# Altium schematic sheet Sheet1.SchDoc
size 431 x 279 mm; SheetNumber: 1; SheetTotal: 1; ENG_APP_DATE: --/--/--; DSN_APP_DATE: --/--/--; CHK_APP_DATE: --/--/--
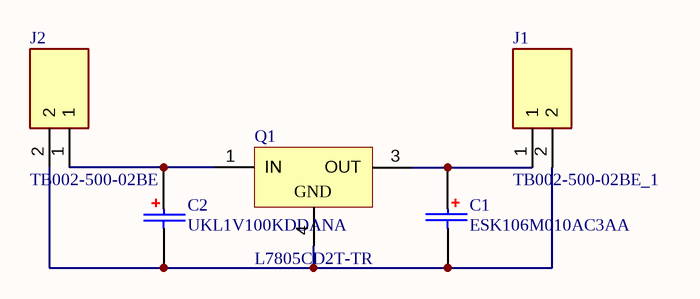
[diagram p0: Sheet1.SchDoc]

## Parts
C1  ESK106M010AC3AA  [ESK106M010AC3AA]
C2  UKL1V100KDDANA  [CAP_UKL_5X11_NCH]
J1  TB002-500-02BE_1  [CUI_TB002-500-02BE - duplicate]
J2  TB002-500-02BE  [CUI_TB002-500-02BE]
Q1  L7805CD2T-TR  [3]

## Nets
NetC1_1: C1.1 J1.1 Q1.3(OUT)
NetC1_2: C1.2 C2.2 J1.2 J2.2 Q1.4(GND)
NetC2_1: C2.1 J2.1 Q1.1(IN)

## Notes on the sheet
- DWG. NO.
- REV.
- SHT.
- THIS DOCUMENT AND THE DATA DISCLOSED HEREIN OR HEREWITH IS THE PROPERTY OF ALTIUM LIMITED AND MAY BE FREELY DISTRIBUTED IN WHOLE. NO RIGHTS ARE RESERVED OR EXPRESS OR IMPLIED WARANTEE GIVEN.
- REVISION
- DESCRIPTION
- DATE
- APPROVED
- ENG:
- APPROVALS
- PROJECT
- DSN:
- CHK:
- REFERENCE DOCUMENTS
- PROJECT REVISION:
- TITLE
- DOCUMENT REVISION:
- DESIGN ITEM:
- BOM:
- FAB DWG:
- PCB DWG:
- ASSY DWG:
- SCALE:
- SIZE
- B
- CAGE CODE
- FILE NAME
- DWG NO.
- SHEET
- OF
- REV

## Library data of the parts
C1 = ESK106M010AC3AA: Aluminum Electrolytic Capacitor, Polarized, Aluminum (wet), 10V, 20% +Tol, 20% -Tol, 10uF, Through Hole Mount; Manufacturer: Yageo Group; Value: 10µF; Leakage Current: 3µA; Ripple Current: 35mA; Supplier: DigiKey; Supplier Part Number: 399-ESK106M010AC3AA-ND; Manufacturer Part Number: ESK106M010AC3AA; RoHS: Compliant; Category: Aluminum Electrolytic Capacitors; Stock: 31925; Pricing: 1=0.22, 10=0.133, 50=0.096, 100=0.0841, 500=0.0635, 1000=0.05698, 2500=0.05, 5000=0.04574 (USD); Diameter: 5mm; Export Control Classification Number (ECCN) Code: EAR99; Harmonized Tariff Schedule (HTS) Code: 8532.22.00.20; Introduction Date: 2006-12-04; Length: 11mm; Lifecycle Status: Production; Max Operating Temperature: 85°C; Min Operating Temperature: -40°C; Number of Terminals: 2; Packaging: Bulk; REACH SVHC: Yes; Terminal Pitch: 2mm; Voltage Rating (DC): 10V; ComponentLink1URL: https://datasheet.octopart.com:443/ESK106M010AC3AA-KEMET-datasheet-182055911.pdf?src-supplier=IHS; ComponentLink1Description: https://datasheet.octopart.com:443/ESK106M010AC3AA-KEMET-datasheet-182055911.pdf?src-supplier=IHS; ComponentLink2URL: https://datasheet.octopart.com:443/ESK106M010AC3AA-KEMET-datasheet-182942742.pdf?src-supplier=Farnell; ComponentLink2Description: https://datasheet.octopart.com:443/ESK106M010AC3AA-KEMET-datasheet-182942742.pdf?src-supplier=Farnell
C2 = UKL1V100KDDANA: Aluminum Electrolytic Capacitor, 10UF, 35V, 10%, Radial; Manufacturer: Nichicon; Value: 10µF; Life (Hours): 1000hours; Polarity: Polar; Supplier: Arrow Electronics; Supplier Part Number: UKL1V100KDDANA; Manufacturer Part Number: UKL1V100KDDANA; RoHS: Compliant; Category: Aluminum Electrolytic Capacitors; Stock: 1313; Pricing: 716=0.1396, 1000=0.1296 (USD); Case/Package: Radial; Lead Pitch: 2mm; Max Operating Temperature: 105°C; Min Operating Temperature: -40°C; Mounting Technology: Through Hole; Schedule B: 8532290040, 8532290040|8532290040|8532290040|8532290040|8532290040|8532290040|8532290040|8532290040|8532290040|8532290040|8532290040|8532290040|8532290040|8532290040|8532290040|8532290040|8532290040|8532290040|8532290040|8532290040|8532290040|8532290040|8532290040|85; Termination: Radial; Tolerance: 10%; Voltage Rating: 35V; Voltage Rating (DC): 35V; ComponentLink1URL: https://datasheet.octopart.com:443/UKL1V100KDDANA-Nichicon-datasheet-41194111.pdf?src-supplier=Newark; ComponentLink1Description: https://datasheet.octopart.com:443/UKL1V100KDDANA-Nichicon-datasheet-41194111.pdf?src-supplier=Newark; ComponentLink2URL: https://datasheet.octopart.com:443/UKL1V100KDDANA-Nichicon-datasheet-21209594.pdf?src-supplier=Newark; ComponentLink2Description: https://datasheet.octopart.com:443/UKL1V100KDDANA-Nichicon-datasheet-21209594.pdf?src-supplier=Newark
J1 = TB002-500-02BE_1: Barrier Strip Terminal Block 15A 3.31Mm2 1 Row Rohs Compliant: Yes |Same Sky TB002-500-02BE; Approvals: CE, EN, IEC, UL, cUL; Number of Contacts: 2; Number of Levels: 1; Pitch: 5mm; Voltage Rating: 300V; Wire/Cable Gauge: 12AWG; Supplier: DigiKey; Supplier Part Number: 102-6145-ND; Manufacturer: Same Sky; Manufacturer Part Number: TB002-500-02BE; RoHS: Compliant; Category: Terminal Blocks; Stock: 34381; Pricing: 1=0.33, 10=0.251, 25=0.22, 50=0.1984, 100=0.1787, 250=0.15652, 500=0.14278, 3000=0.11772, 6000=0.11131 (USD); Color: Blue; Current Rating: 15A; Export Control Classification Number (ECCN) Code: EAR99; Height: 10mm; Harmonized Tariff Schedule (HTS) Code: 8536.90.40.00; Introduction Date: 2024-10-09; Lifecycle Status: Production; Max Operating Temperature: 105°C; Min Operating Temperature: -40°C; Mounting Technology: Screw; Pins: 2; Number of Rows: 1; Orientation: Horizontal; REACH SVHC: No; Width: 7.6mm; ComponentLink1URL: https://datasheet.octopart.com:443/TB002-500-02BE-Same-Sky-datasheet-181920249.pdf?src-supplier=Same+Sky; ComponentLink1Description: https://datasheet.octopart.com:443/TB002-500-02BE-Same-Sky-datasheet-181920249.pdf?src-supplier=Same+Sky; ComponentLink2URL: https://datasheet.octopart.com:443/TB002-500-02BE-CUI-Devices-datasheet-175928133.pdf?src-supplier=Same+Sky; ComponentLink2Description: https://datasheet.octopart.com:443/TB002-500-02BE-CUI-Devices-datasheet-175928133.pdf?src-supplier=Same+Sky; ComponentLink3URL: https://datasheet.octopart.com:443/TB002-500-02BE-CUI-Devices-datasheet-144794938.pdf?src-supplier=Same+Sky; ComponentLink3Description: https://datasheet.octopart.com:443/TB002-500-02BE-CUI-Devices-datasheet-144794938.pdf?src-supplier=Same+Sky; ComponentLink4URL: https://datasheet.octopart.com:443/TB002-500-02BE-CUI-Devices-datasheet-180438470.pdf?src-supplier=IHS; ComponentLink4Description: https://datasheet.octopart.com:443/TB002-500-02BE-CUI-Devices-datasheet-180438470.pdf?src-supplier=IHS; ComponentLink5URL: https://datasheet.octopart.com:443/TB002-500-02BE-Same-Sky-datasheet-190142077.pdf?src-supplier=element14+APAC; ComponentLink5Description: https://datasheet.octopart.com:443/TB002-500-02BE-Same-Sky-datasheet-190142077.pdf?src-supplier=element14+APAC; ComponentLink6URL: https://datasheet.octopart.com:443/TB002-500-02BE-Same-Sky-datasheet-182881440.pdf?src-supplier=Electro+Sonic; ComponentLink6Description: https://datasheet.octopart.com:443/TB002-500-02BE-Same-Sky-datasheet-182881440.pdf?src-supplier=Electro+Sonic; ComponentLink7URL: https://datasheet.octopart.com:443/TB002-500-02BE-CUI-Devices-datasheet-154730744.pdf?src-supplier=Electro+Sonic; ComponentLink7Description: https://datasheet.octopart.com:443/TB002-500-02BE-CUI-Devices-datasheet-154730744.pdf?src-supplier=Electro+Sonic; ComponentLink8URL: https://datasheet.octopart.com:443/TB002-500-02BE-Same-Sky-datasheet-189105710.pdf?src-supplier=Master+Electronics; ComponentLink8Description: https://datasheet.octopart.com:443/TB002-500-02BE-Same-Sky-datasheet-189105710.pdf?src-supplier=Master+Electronics; ComponentLink9URL: https://datasheet.octopart.com:443/TB002-500-02BE-Same-Sky-datasheet-182050243.pdf?src-supplier=Future+Electronics; ComponentLink9Description: https://datasheet.octopart.com:443/TB002-500-02BE-Same-Sky-datasheet-182050243.pdf?src-supplier=Future+Electronics; ComponentLink10URL: https://datasheet.octopart.com:443/TB002-500-02BE-CUI-Devices-datasheet-175928501.pdf?src-supplier=Future+Electronics; ComponentLink10Description: https://datasheet.octopart.com:443/TB002-500-02BE-CUI-Devices-datasheet-175928501.pdf?src-supplier=Future+Electronics; ComponentLink11URL: https://datasheet.octopart.com:443/TB002-500-02BE-CUI-Devices-datasheet-147843962.pdf?src-supplier=Future+Electronics; ComponentLink11Description: https://datasheet.octopart.com:443/TB002-500-02BE-CUI-Devices-datasheet-147843962.pdf?src-supplier=Future+Electronics; ComponentLink12URL: https://datasheet.octopart.com:443/TB002-500-02BE-CUI-Devices-datasheet-175927966.pdf?src-supplier=CUI+Devices+SCT; ComponentLink12Description: https://datasheet.octopart.com:443/TB002-500-02BE-CUI-Devices-datasheet-175927966.pdf?src-supplier=CUI+Devices+SCT; ComponentLink13URL: https://datasheet.octopart.com:443/TB002-500-02BE-CUI-Devices-datasheet-142371903.pdf?src-supplier=CUI+Devices+SCT; ComponentLink13Description: https://datasheet.octopart.com:443/TB002-500-02BE-CUI-Devices-datasheet-142371903.pdf?src-supplier=CUI+Devices+SCT; ComponentLink14URL: https://octopart.com:443/opatz8j6/c1?t=daKBr15hyLfguRN5uL4lqHwqeBTS6az6UucewCHyGpHtbux7pAfp6Q9QTNCXQgOeNdQI5afNcTbVzuunJIpqJo1-AAwsQ2Q7JOXJZD681kNYD1MgHtXQHZHp1a0nqQtGAiROF49UX8-aPEOMvwhp8kgluEx9dPMerVMsFpBX7o971noVxpZNPL8Hx6Gpa6r9mfx1LNEp29a1YZcEevAsGAGUzEl2dkpqtMJYMZmyUQjREWhpQSjNqecDkfUZGekDVGXfEcG2TRJlxSfy9vfBJeva8kdH7IQ0IVFh_6hMjsgc6sAg4IaeyZW4NT_AhTfA9Bm9OYf2zlsTSP3XXn_68K8kkp-OnblrwRCl164jRg8MMQ&src-supplier=Compliance+Statements; ComponentLink14Description: https://octopart.com:443/opatz8j6/c1?t=daKBr15hyLfguRN5uL4lqHwqeBTS6az6UucewCHyGpHtbux7pAfp6Q9QTNCXQgOeNdQI5afNcTbVzuunJIpqJo1-AAwsQ2Q7JOXJZD681kNYD1MgHtXQHZHp1a0nqQtGAiROF49UX8-aPEOMvwhp8kgluEx9dPMerVMsFpBX7o971noVxpZNPL8Hx6Gpa6r9mfx1LNEp29a1YZcEevAsGAGUzEl2dkpqtMJYMZmyUQjREWhpQSjNqecDkfUZGekDVGXfEcG2TRJlxSfy9vfBJeva8kdH7IQ0IVFh_6hMjsgc6sAg4IaeyZW4NT_AhTfA9Bm9OYf2zlsTSP3XXn_68K8kkp-OnblrwRCl164jRg8MMQ&src-supplier=Compliance+Statements; ComponentLink15URL: https://octopart.com:443/opatz8j6/c1?t=zlDsDuB8Wed5ydZmw8jFMRsA8Ara5MDCNrUaIAHxqjyN6vx98jw4VnAGME3ScJGCxj47SrSmKWgHBCn-rFMB4ZC3UR8QbcT0CNN9dQPCpKwHKvJBjhUr0Cc3P59X1v-rX_KJ4iyG6mpbrB21C3EBek8w_56z5cqdj2kGiI-RC-b0iWoknjsJGcZJ7qMZ4pM9OpDpdClOUvaERoFT87nGO8QMYDFPVhkITy7GuzVBxmCx_Iz70dqc9wYrFUSQHKH-wqo17XScDRowI-te1iX7ZQ96WPgM7ocEB65Ptcncwv82UAUFxSU-ZbfbRWRth_BEn15Jj-QLglzApIC_l7nFdInrGmwm-kH9RoGbdipM&src-supplier=Compliance+Statements; ComponentLink15Description: https://octopart.com:443/opatz8j6/c1?t=zlDsDuB8Wed5ydZmw8jFMRsA8Ara5MDCNrUaIAHxqjyN6vx98jw4VnAGME3ScJGCxj47SrSmKWgHBCn-rFMB4ZC3UR8QbcT0CNN9dQPCpKwHKvJBjhUr0Cc3P59X1v-rX_KJ4iyG6mpbrB21C3EBek8w_56z5cqdj2kGiI-RC-b0iWoknjsJGcZJ7qMZ4pM9OpDpdClOUvaERoFT87nGO8QMYDFPVhkITy7GuzVBxmCx_Iz70dqc9wYrFUSQHKH-wqo17XScDRowI-te1iX7ZQ96WPgM7ocEB65Ptcncwv82UAUFxSU-ZbfbRWRth_BEn15Jj-QLglzApIC_l7nFdInrGmwm-kH9RoGbdipM&src-supplier=Compliance+Statements; ComponentLink16URL: https://octopart.com:443/opatz8j6/c1?t=EWJW4z4XJi7pQiIZnWuGCfUnRu0ZN4v9GnIyKU2Q7zR-Wd37eki--RRH7MgCaHpQbiJwnDn8Frgwb2ersLG33WwjXx4BsND04t8rFqVurkeLStMIXmGI8cNHmKCj-BCAkUnWXSAQ2snsAsqjLUqg6-hP3W5-V0VbKwjBsYWtlNCJzACsJ3N0Pk6rg4zOJDPFqQrxlEAltsulaj6ZjZlQ3q-Y1DKbDmgONhU2NgiMFg9fSQjUP7rx1X0m8hRymFov1EzBC4OrloELxhiUuHPXXp0CVZMcl3T5lkY7d4XdTM7N-SAKnWAcyezcHeXTBawL8JV9dWi9l8duXjkjrJCzJlcJ-meM_jYAnu5rfZ5g2E_9xw&src-supplier=Compliance+Statements; ComponentLink16Description: https://octopart.com:443/opatz8j6/c1?t=EWJW4z4XJi7pQiIZnWuGCfUnRu0ZN4v9GnIyKU2Q7zR-Wd37eki--RRH7MgCaHpQbiJwnDn8Frgwb2ersLG33WwjXx4BsND04t8rFqVurkeLStMIXmGI8cNHmKCj-BCAkUnWXSAQ2snsAsqjLUqg6-hP3W5-V0VbKwjBsYWtlNCJzACsJ3N0Pk6rg4zOJDPFqQrxlEAltsulaj6ZjZlQ3q-Y1DKbDmgONhU2NgiMFg9fSQjUP7rx1X0m8hRymFov1EzBC4OrloELxhiUuHPXXp0CVZMcl3T5lkY7d4XdTM7N-SAKnWAcyezcHeXTBawL8JV9dWi9l8duXjkjrJCzJlcJ-meM_jYAnu5rfZ5g2E_9xw&src-supplier=Compliance+Statements; ComponentLink17URL: https://octopart.com:443/opatz8j6/c1?t=-oFJp4s286qNHvtoD2sI4obiiM3f3ZehqgE9hmXp3EI9PlQz1D01F7GaALZrUSRmFFvymU-LPWxG06MbCGc2ZY5TyZVTnJ_kA4vhYiCoKt1zkHzlKfJJsA5blW3U2kSfIgjaDy43q_XJT2g3XxMdO2I5pwfNScTUKNHDD-GtoZItPQ5-9ldbL0ohlBdl9uYO8B-TCkdG5OoHFKexMb_OuUnDeUuET5p44IIsKIsqDM6BGWGXXeLy1F8-Oxi0NW1hLCwG2fvyj7l-m3XVzD2x8eyAwNGLXhsrsWiY3E1M0w6jjBeSui3X-iw7gCcZbIw8KaT6YRWKdUle1InoHCrQLBF_0zC7yoT7t99L0yBf&src-supplier=Compliance+Statements; ComponentLink17Description: https://octopart.com:443/opatz8j6/c1?t=-oFJp4s286qNHvtoD2sI4obiiM3f3ZehqgE9hmXp3EI9PlQz1D01F7GaALZrUSRmFFvymU-LPWxG06MbCGc2ZY5TyZVTnJ_kA4vhYiCoKt1zkHzlKfJJsA5blW3U2kSfIgjaDy43q_XJT2g3XxMdO2I5pwfNScTUKNHDD-GtoZItPQ5-9ldbL0ohlBdl9uYO8B-TCkdG5OoHFKexMb_OuUnDeUuET5p44IIsKIsqDM6BGWGXXeLy1F8-Oxi0NW1hLCwG2fvyj7l-m3XVzD2x8eyAwNGLXhsrsWiY3E1M0w6jjBeSui3X-iw7gCcZbIw8KaT6YRWKdUle1InoHCrQLBF_0zC7yoT7t99L0yBf&src-supplier=Compliance+Statements
J2 = TB002-500-02BE: Barrier Strip Terminal Block 15A 3.31Mm2 1 Row Rohs Compliant: Yes |Same Sky TB002-500-02BE; Approvals: CE, EN, IEC, UL, cUL; Number of Contacts: 2; Number of Levels: 1; Pitch: 5mm; Voltage Rating: 300V; Wire/Cable Gauge: 12AWG; Supplier: DigiKey; Supplier Part Number: 102-6145-ND; Manufacturer: Same Sky; Manufacturer Part Number: TB002-500-02BE; RoHS: Compliant; Category: Terminal Blocks; Stock: 34381; Pricing: 1=0.33, 10=0.251, 25=0.22, 50=0.1984, 100=0.1787, 250=0.15652, 500=0.14278, 3000=0.11772, 6000=0.11131 (USD); Color: Blue; Current Rating: 15A; Export Control Classification Number (ECCN) Code: EAR99; Height: 10mm; Harmonized Tariff Schedule (HTS) Code: 8536.90.40.00; Introduction Date: 2024-10-09; Lifecycle Status: Production; Max Operating Temperature: 105°C; Min Operating Temperature: -40°C; Mounting Technology: Screw; Pins: 2; Number of Rows: 1; Orientation: Horizontal; REACH SVHC: No; Width: 7.6mm; ComponentLink1URL: https://datasheet.octopart.com:443/TB002-500-02BE-Same-Sky-datasheet-181920249.pdf?src-supplier=Same+Sky; ComponentLink1Description: https://datasheet.octopart.com:443/TB002-500-02BE-Same-Sky-datasheet-181920249.pdf?src-supplier=Same+Sky; ComponentLink2URL: https://datasheet.octopart.com:443/TB002-500-02BE-CUI-Devices-datasheet-175928133.pdf?src-supplier=Same+Sky; ComponentLink2Description: https://datasheet.octopart.com:443/TB002-500-02BE-CUI-Devices-datasheet-175928133.pdf?src-supplier=Same+Sky; ComponentLink3URL: https://datasheet.octopart.com:443/TB002-500-02BE-CUI-Devices-datasheet-144794938.pdf?src-supplier=Same+Sky; ComponentLink3Description: https://datasheet.octopart.com:443/TB002-500-02BE-CUI-Devices-datasheet-144794938.pdf?src-supplier=Same+Sky; ComponentLink4URL: https://datasheet.octopart.com:443/TB002-500-02BE-CUI-Devices-datasheet-180438470.pdf?src-supplier=IHS; ComponentLink4Description: https://datasheet.octopart.com:443/TB002-500-02BE-CUI-Devices-datasheet-180438470.pdf?src-supplier=IHS; ComponentLink5URL: https://datasheet.octopart.com:443/TB002-500-02BE-Same-Sky-datasheet-190142077.pdf?src-supplier=element14+APAC; ComponentLink5Description: https://datasheet.octopart.com:443/TB002-500-02BE-Same-Sky-datasheet-190142077.pdf?src-supplier=element14+APAC; ComponentLink6URL: https://datasheet.octopart.com:443/TB002-500-02BE-Same-Sky-datasheet-182881440.pdf?src-supplier=Electro+Sonic; ComponentLink6Description: https://datasheet.octopart.com:443/TB002-500-02BE-Same-Sky-datasheet-182881440.pdf?src-supplier=Electro+Sonic; ComponentLink7URL: https://datasheet.octopart.com:443/TB002-500-02BE-CUI-Devices-datasheet-154730744.pdf?src-supplier=Electro+Sonic; ComponentLink7Description: https://datasheet.octopart.com:443/TB002-500-02BE-CUI-Devices-datasheet-154730744.pdf?src-supplier=Electro+Sonic; ComponentLink8URL: https://datasheet.octopart.com:443/TB002-500-02BE-Same-Sky-datasheet-189105710.pdf?src-supplier=Master+Electronics; ComponentLink8Description: https://datasheet.octopart.com:443/TB002-500-02BE-Same-Sky-datasheet-189105710.pdf?src-supplier=Master+Electronics; ComponentLink9URL: https://datasheet.octopart.com:443/TB002-500-02BE-Same-Sky-datasheet-182050243.pdf?src-supplier=Future+Electronics; ComponentLink9Description: https://datasheet.octopart.com:443/TB002-500-02BE-Same-Sky-datasheet-182050243.pdf?src-supplier=Future+Electronics; ComponentLink10URL: https://datasheet.octopart.com:443/TB002-500-02BE-CUI-Devices-datasheet-175928501.pdf?src-supplier=Future+Electronics; ComponentLink10Description: https://datasheet.octopart.com:443/TB002-500-02BE-CUI-Devices-datasheet-175928501.pdf?src-supplier=Future+Electronics; ComponentLink11URL: https://datasheet.octopart.com:443/TB002-500-02BE-CUI-Devices-datasheet-147843962.pdf?src-supplier=Future+Electronics; ComponentLink11Description: https://datasheet.octopart.com:443/TB002-500-02BE-CUI-Devices-datasheet-147843962.pdf?src-supplier=Future+Electronics; ComponentLink12URL: https://datasheet.octopart.com:443/TB002-500-02BE-CUI-Devices-datasheet-175927966.pdf?src-supplier=CUI+Devices+SCT; ComponentLink12Description: https://datasheet.octopart.com:443/TB002-500-02BE-CUI-Devices-datasheet-175927966.pdf?src-supplier=CUI+Devices+SCT; ComponentLink13URL: https://datasheet.octopart.com:443/TB002-500-02BE-CUI-Devices-datasheet-142371903.pdf?src-supplier=CUI+Devices+SCT; ComponentLink13Description: https://datasheet.octopart.com:443/TB002-500-02BE-CUI-Devices-datasheet-142371903.pdf?src-supplier=CUI+Devices+SCT; ComponentLink14URL: https://octopart.com:443/opatz8j6/c1?t=daKBr15hyLfguRN5uL4lqHwqeBTS6az6UucewCHyGpHtbux7pAfp6Q9QTNCXQgOeNdQI5afNcTbVzuunJIpqJo1-AAwsQ2Q7JOXJZD681kNYD1MgHtXQHZHp1a0nqQtGAiROF49UX8-aPEOMvwhp8kgluEx9dPMerVMsFpBX7o971noVxpZNPL8Hx6Gpa6r9mfx1LNEp29a1YZcEevAsGAGUzEl2dkpqtMJYMZmyUQjREWhpQSjNqecDkfUZGekDVGXfEcG2TRJlxSfy9vfBJeva8kdH7IQ0IVFh_6hMjsgc6sAg4IaeyZW4NT_AhTfA9Bm9OYf2zlsTSP3XXn_68K8kkp-OnblrwRCl164jRg8MMQ&src-supplier=Compliance+Statements; ComponentLink14Description: https://octopart.com:443/opatz8j6/c1?t=daKBr15hyLfguRN5uL4lqHwqeBTS6az6UucewCHyGpHtbux7pAfp6Q9QTNCXQgOeNdQI5afNcTbVzuunJIpqJo1-AAwsQ2Q7JOXJZD681kNYD1MgHtXQHZHp1a0nqQtGAiROF49UX8-aPEOMvwhp8kgluEx9dPMerVMsFpBX7o971noVxpZNPL8Hx6Gpa6r9mfx1LNEp29a1YZcEevAsGAGUzEl2dkpqtMJYMZmyUQjREWhpQSjNqecDkfUZGekDVGXfEcG2TRJlxSfy9vfBJeva8kdH7IQ0IVFh_6hMjsgc6sAg4IaeyZW4NT_AhTfA9Bm9OYf2zlsTSP3XXn_68K8kkp-OnblrwRCl164jRg8MMQ&src-supplier=Compliance+Statements; ComponentLink15URL: https://octopart.com:443/opatz8j6/c1?t=zlDsDuB8Wed5ydZmw8jFMRsA8Ara5MDCNrUaIAHxqjyN6vx98jw4VnAGME3ScJGCxj47SrSmKWgHBCn-rFMB4ZC3UR8QbcT0CNN9dQPCpKwHKvJBjhUr0Cc3P59X1v-rX_KJ4iyG6mpbrB21C3EBek8w_56z5cqdj2kGiI-RC-b0iWoknjsJGcZJ7qMZ4pM9OpDpdClOUvaERoFT87nGO8QMYDFPVhkITy7GuzVBxmCx_Iz70dqc9wYrFUSQHKH-wqo17XScDRowI-te1iX7ZQ96WPgM7ocEB65Ptcncwv82UAUFxSU-ZbfbRWRth_BEn15Jj-QLglzApIC_l7nFdInrGmwm-kH9RoGbdipM&src-supplier=Compliance+Statements; ComponentLink15Description: https://octopart.com:443/opatz8j6/c1?t=zlDsDuB8Wed5ydZmw8jFMRsA8Ara5MDCNrUaIAHxqjyN6vx98jw4VnAGME3ScJGCxj47SrSmKWgHBCn-rFMB4ZC3UR8QbcT0CNN9dQPCpKwHKvJBjhUr0Cc3P59X1v-rX_KJ4iyG6mpbrB21C3EBek8w_56z5cqdj2kGiI-RC-b0iWoknjsJGcZJ7qMZ4pM9OpDpdClOUvaERoFT87nGO8QMYDFPVhkITy7GuzVBxmCx_Iz70dqc9wYrFUSQHKH-wqo17XScDRowI-te1iX7ZQ96WPgM7ocEB65Ptcncwv82UAUFxSU-ZbfbRWRth_BEn15Jj-QLglzApIC_l7nFdInrGmwm-kH9RoGbdipM&src-supplier=Compliance+Statements; ComponentLink16URL: https://octopart.com:443/opatz8j6/c1?t=EWJW4z4XJi7pQiIZnWuGCfUnRu0ZN4v9GnIyKU2Q7zR-Wd37eki--RRH7MgCaHpQbiJwnDn8Frgwb2ersLG33WwjXx4BsND04t8rFqVurkeLStMIXmGI8cNHmKCj-BCAkUnWXSAQ2snsAsqjLUqg6-hP3W5-V0VbKwjBsYWtlNCJzACsJ3N0Pk6rg4zOJDPFqQrxlEAltsulaj6ZjZlQ3q-Y1DKbDmgONhU2NgiMFg9fSQjUP7rx1X0m8hRymFov1EzBC4OrloELxhiUuHPXXp0CVZMcl3T5lkY7d4XdTM7N-SAKnWAcyezcHeXTBawL8JV9dWi9l8duXjkjrJCzJlcJ-meM_jYAnu5rfZ5g2E_9xw&src-supplier=Compliance+Statements; ComponentLink16Description: https://octopart.com:443/opatz8j6/c1?t=EWJW4z4XJi7pQiIZnWuGCfUnRu0ZN4v9GnIyKU2Q7zR-Wd37eki--RRH7MgCaHpQbiJwnDn8Frgwb2ersLG33WwjXx4BsND04t8rFqVurkeLStMIXmGI8cNHmKCj-BCAkUnWXSAQ2snsAsqjLUqg6-hP3W5-V0VbKwjBsYWtlNCJzACsJ3N0Pk6rg4zOJDPFqQrxlEAltsulaj6ZjZlQ3q-Y1DKbDmgONhU2NgiMFg9fSQjUP7rx1X0m8hRymFov1EzBC4OrloELxhiUuHPXXp0CVZMcl3T5lkY7d4XdTM7N-SAKnWAcyezcHeXTBawL8JV9dWi9l8duXjkjrJCzJlcJ-meM_jYAnu5rfZ5g2E_9xw&src-supplier=Compliance+Statements; ComponentLink17URL: https://octopart.com:443/opatz8j6/c1?t=-oFJp4s286qNHvtoD2sI4obiiM3f3ZehqgE9hmXp3EI9PlQz1D01F7GaALZrUSRmFFvymU-LPWxG06MbCGc2ZY5TyZVTnJ_kA4vhYiCoKt1zkHzlKfJJsA5blW3U2kSfIgjaDy43q_XJT2g3XxMdO2I5pwfNScTUKNHDD-GtoZItPQ5-9ldbL0ohlBdl9uYO8B-TCkdG5OoHFKexMb_OuUnDeUuET5p44IIsKIsqDM6BGWGXXeLy1F8-Oxi0NW1hLCwG2fvyj7l-m3XVzD2x8eyAwNGLXhsrsWiY3E1M0w6jjBeSui3X-iw7gCcZbIw8KaT6YRWKdUle1InoHCrQLBF_0zC7yoT7t99L0yBf&src-supplier=Compliance+Statements; ComponentLink17Description: https://octopart.com:443/opatz8j6/c1?t=-oFJp4s286qNHvtoD2sI4obiiM3f3ZehqgE9hmXp3EI9PlQz1D01F7GaALZrUSRmFFvymU-LPWxG06MbCGc2ZY5TyZVTnJ_kA4vhYiCoKt1zkHzlKfJJsA5blW3U2kSfIgjaDy43q_XJT2g3XxMdO2I5pwfNScTUKNHDD-GtoZItPQ5-9ldbL0ohlBdl9uYO8B-TCkdG5OoHFKexMb_OuUnDeUuET5p44IIsKIsqDM6BGWGXXeLy1F8-Oxi0NW1hLCwG2fvyj7l-m3XVzD2x8eyAwNGLXhsrsWiY3E1M0w6jjBeSui3X-iw7gCcZbIw8KaT6YRWKdUle1InoHCrQLBF_0zC7yoT7t99L0yBf&src-supplier=Compliance+Statements
Q1 = L7805CD2T-TR: Linear Voltage Regulator, Fixed, Positive Output, 35 V, 5 V, 1.5 A, 3 Pins, TO-263 (D2PAK); Manufacturer: STMicroelectronics; Dropout Voltage: 2V; Max Supply Voltage: 18V; Max Junction Temperature (Tj): 125°C; Max Output current: 1.5A; Min Input Voltage: 7V; Min Output Voltage: 4.8V; Nominal Output Voltage: 5V; Nominal Supply Current: 4.3mA; Number of Channels: 1; Power Supply Rejection Ratio (PSRR): 62dB; Quiescent Current: 8mA; Voltage Tolerance: 4%; Supplier: DigiKey; Supplier Part Number: 497-1171-6-ND; Manufacturer Part Number: L7805CD2T-TR; RoHS: Compliant; Category: Voltage Regulators - Linear; Stock: 22430; Pricing: 1=0.78, 10=0.559, 25=0.5024, 100=0.4402, 250=0.41056, 500=0.3927 (USD); Case/Package: TO-263; China RoHS: Non-Compliant; Contact Plating: Tin; Country of Origin: Mainland China; Export Control Classification Number (ECCN) Code: EAR99; Height: 4.83mm; Height - Seated (Max): 4.83mm; Harmonized Tariff Schedule (HTS) Code: 8542.39.00.60; Introduction Date: 1980-01-04; Lead Free: Lead Free; Length: 10.2mm; Lifecycle Status: Production; Max Operating Temperature: 125°C; Min Operating Temperature: -40°C; Mounting Technology: Surface Mount; Number of Circuits: 1; Number of Outputs: 1; Pins: 3; Number of Regulators: 1; Number of Terminals: 2; Output Current: 1.5A; Output Type: Fixed; Output Voltage: 5V; Packaging: Tape and Reel; Polarity: Positive; Radiation Hardening: No; REACH SVHC: No; Schedule B: 8542390000, 8542390000|8542390000|8542390000|8542390000|8542390000|8542390000|8542390000|8542390000|8542390000|8542390000|8542390000|8542390000|8542390000|8542390000|8542390000|8542390000|8542390000|8542390000|8542390000|8542390000|8542390000|8542390000|8542390000|85; Terminal Pitch: 2.54mm; Weight: 2.012816mg; Width: 9.15mm; ComponentLink1URL: https://datasheet.octopart.com:443/L7805CD2T-TR-STMicroelectronics-datasheet-136036604.pdf?src-supplier=ODG+(Origin+Data+Global); ComponentLink1Description: https://datasheet.octopart.com:443/L7805CD2T-TR-STMicroelectronics-datasheet-136036604.pdf?src-supplier=ODG+(Origin+Data+Global); ComponentLink2URL: https://datasheet.octopart.com:443/L7805CD2T-TR-STMicroelectronics-datasheet-5316848.pdf?src-supplier=STMicroelectronics; ComponentLink2Description: https://datasheet.octopart.com:443/L7805CD2T-TR-STMicroelectronics-datasheet-5316848.pdf?src-supplier=STMicroelectronics; ComponentLink3URL: https://datasheet.octopart.com:443/L7805CD2T-TR-STMicroelectronics-datasheet-12510217.pdf?src-supplier=STMicroelectronics; ComponentLink3Description: https://datasheet.octopart.com:443/L7805CD2T-TR-STMicroelectronics-datasheet-12510217.pdf?src-supplier=STMicroelectronics; ComponentLink4URL: https://datasheet.octopart.com:443/L7805CD2T-TR-STMicroelectronics-datasheet-62333152.pdf?src-supplier=STMicroelectronics; ComponentLink4Description: https://datasheet.octopart.com:443/L7805CD2T-TR-STMicroelectronics-datasheet-62333152.pdf?src-supplier=STMicroelectronics; ComponentLink5URL: https://datasheet.octopart.com:443/L7805CD2T-TR-STMicroelectronics-datasheet-11003276.pdf?src-supplier=Farnell; ComponentLink5Description: https://datasheet.octopart.com:443/L7805CD2T-TR-STMicroelectronics-datasheet-11003276.pdf?src-supplier=Farnell; ComponentLink6URL: https://datasheet.octopart.com:443/L7805CD2T-TR-STMicroelectronics-datasheet-10835933.pdf?src-supplier=Future+Electronics; ComponentLink6Description: https://datasheet.octopart.com:443/L7805CD2T-TR-STMicroelectronics-datasheet-10835933.pdf?src-supplier=Future+Electronics; ComponentLink7URL: https://datasheet.octopart.com:443/L7805CD2T-TR-STMicroelectronics-datasheet-10550045.pdf?src-supplier=Future+Electronics; ComponentLink7Description: https://datasheet.octopart.com:443/L7805CD2T-TR-STMicroelectronics-datasheet-10550045.pdf?src-supplier=Future+Electronics; ComponentLink8URL: https://datasheet.octopart.com:443/L7805CD2T-TR-STMicroelectronics-datasheet-10406743.pdf?src-supplier=Future+Electronics; ComponentLink8Description: https://datasheet.octopart.com:443/L7805CD2T-TR-STMicroelectronics-datasheet-10406743.pdf?src-supplier=Future+Electronics; ComponentLink9URL: https://datasheet.octopart.com:443/L7805CD2T-TR-STMicroelectronics-datasheet-10082731.pdf?src-supplier=Future+Electronics; ComponentLink9Description: https://datasheet.octopart.com:443/L7805CD2T-TR-STMicroelectronics-datasheet-10082731.pdf?src-supplier=Future+Electronics; ComponentLink10URL: https://datasheet.octopart.com:443/L7805CD2T-TR-STMicroelectronics-datasheet-8494008.pdf?src-supplier=Future+Electronics; ComponentLink10Description: https://datasheet.octopart.com:443/L7805CD2T-TR-STMicroelectronics-datasheet-8494008.pdf?src-supplier=Future+Electronics; ComponentLink11URL: https://datasheet.octopart.com:443/L7805CD2T-TR-STMicroelectronics-datasheet-73860655.pdf?src-supplier=Augswan; ComponentLink11Description: https://datasheet.octopart.com:443/L7805CD2T-TR-STMicroelectronics-datasheet-73860655.pdf?src-supplier=Augswan; ComponentLink12URL: https://datasheet.octopart.com:443/L7805CD2T-TR-STMicroelectronics-datasheet-14717135.pdf?src-supplier=element14+APAC; ComponentLink12Description: https://datasheet.octopart.com:443/L7805CD2T-TR-STMicroelectronics-datasheet-14717135.pdf?src-supplier=element14+APAC; ComponentLink13URL: https://datasheet.octopart.com:443/L7805CD2T-TR-STMicroelectronics-datasheet-25360458.pdf?src-supplier=Newark; ComponentLink13Description: https://datasheet.octopart.com:443/L7805CD2T-TR-STMicroelectronics-datasheet-25360458.pdf?src-supplier=Newark; ComponentLink14URL: https://datasheet.octopart.com:443/L7805CD2T-TR-STMicroelectronics-datasheet-8464528.pdf?src-supplier=element14; ComponentLink14Description: https://datasheet.octopart.com:443/L7805CD2T-TR-STMicroelectronics-datasheet-8464528.pdf?src-supplier=element14; ComponentLink15URL: https://datasheet.octopart.com:443/L7805CD2T-TR-STMicroelectronics-datasheet-5578.pdf?src-supplier=DigiKey; ComponentLink15Description: https://datasheet.octopart.com:443/L7805CD2T-TR-STMicroelectronics-datasheet-5578.pdf?src-supplier=DigiKey; ComponentLink16URL: https://datasheet.octopart.com:443/L7805CD2T-TR-STMicroelectronics-datasheet-14169698.pdf?src-supplier=iiiC; ComponentLink16Description: https://datasheet.octopart.com:443/L7805CD2T-TR-STMicroelectronics-datasheet-14169698.pdf?src-supplier=iiiC; ComponentLink17URL: https://datasheet.octopart.com:443/L7805CD2T-TR-STMicroelectronics-datasheet-13729504.pdf?src-supplier=Jameco; ComponentLink17Description: https://datasheet.octopart.com:443/L7805CD2T-TR-STMicroelectronics-datasheet-13729504.pdf?src-supplier=Jameco; ComponentLink18URL: https://datasheet.octopart.com:443/L7805CD2T-TR-STMicroelectronics-datasheet-109553.pdf?src-supplier=Nu+Horizons; ComponentLink18Description: https://datasheet.octopart.com:443/L7805CD2T-TR-STMicroelectronics-datasheet-109553.pdf?src-supplier=Nu+Horizons